# EAGLE design GD32VF103CBT6-Modul (EAGLE 9.6.2)
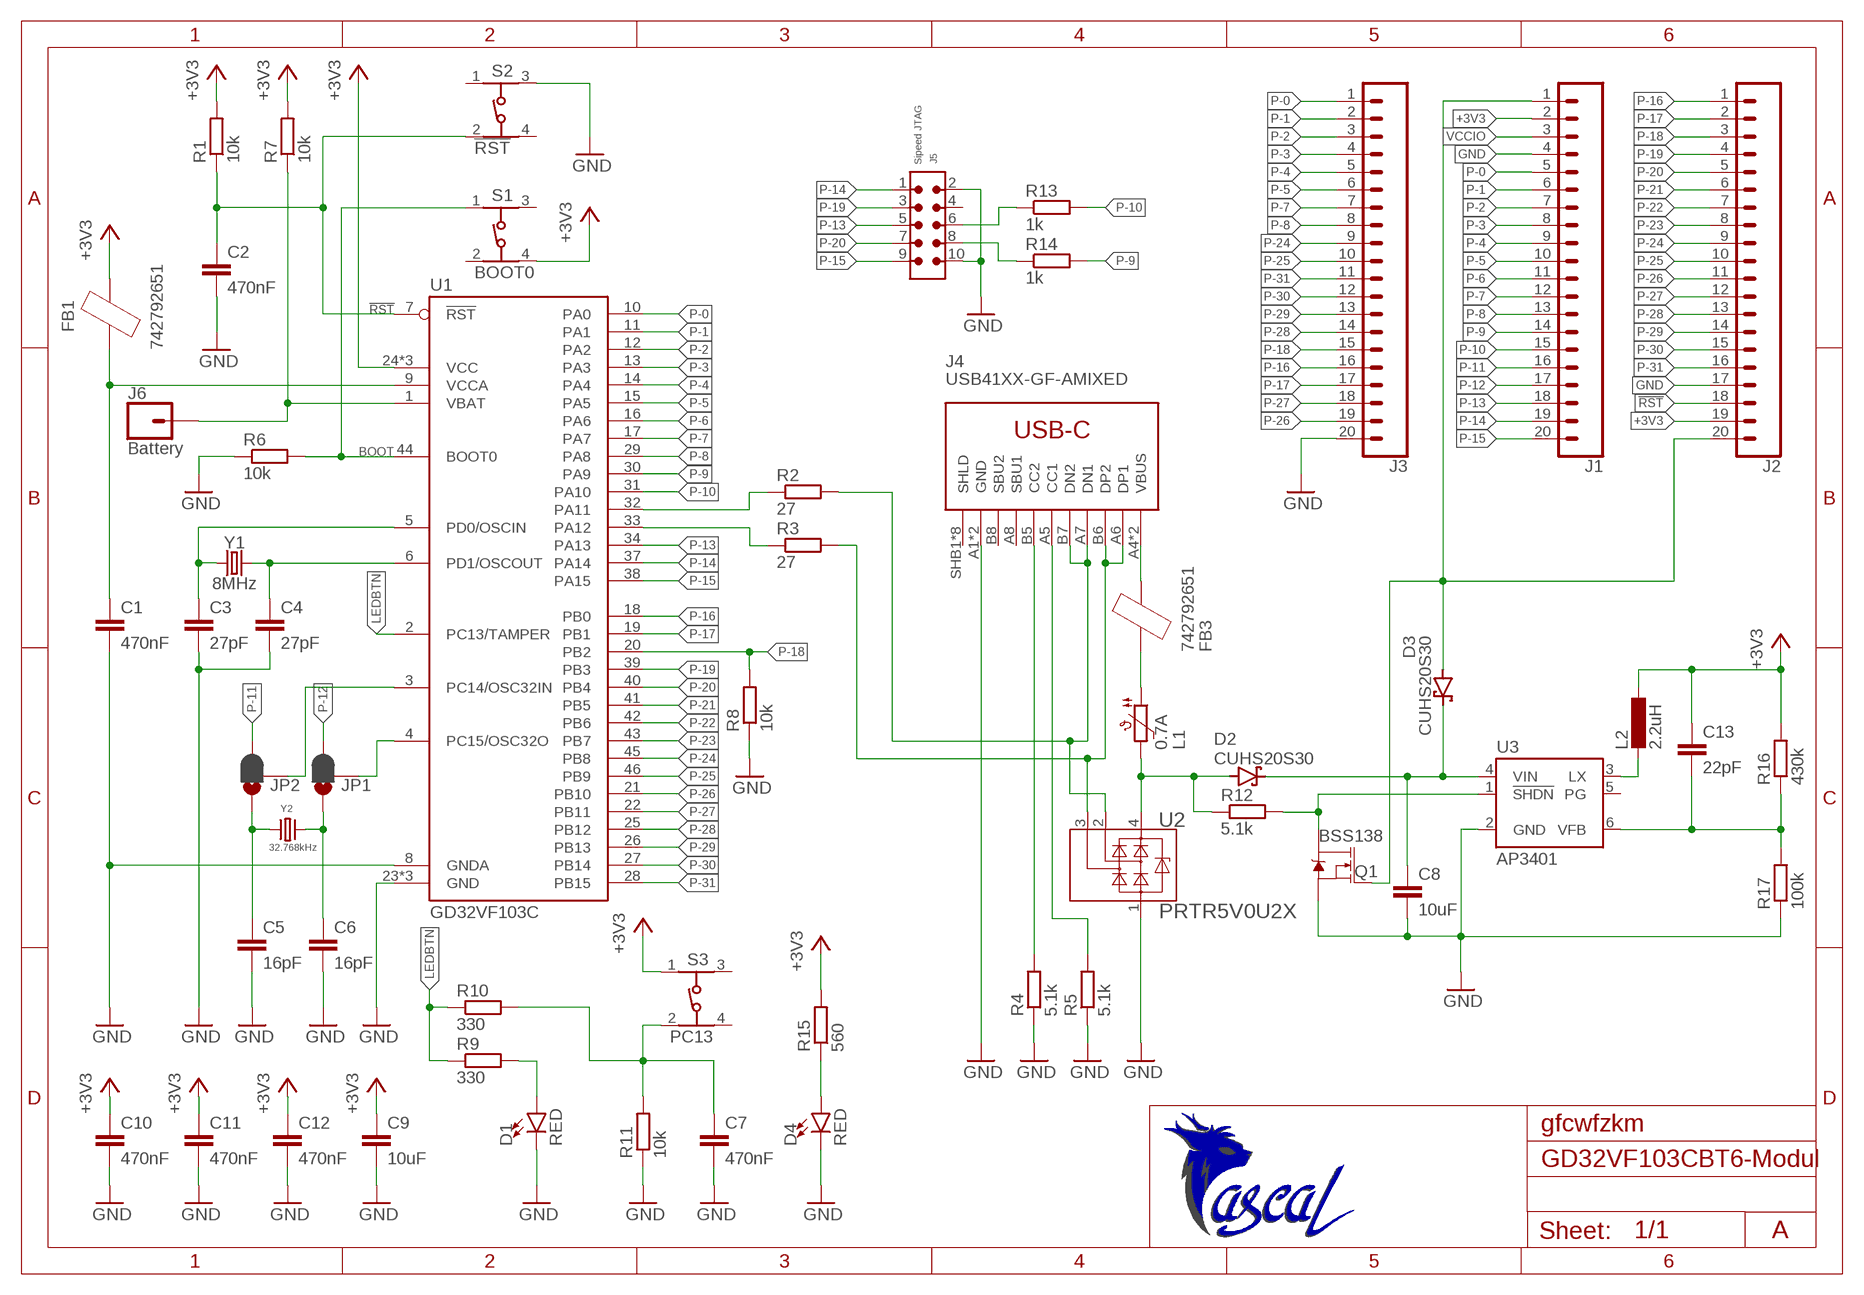
[diagram p0: schematic, sheet 1]

## Parts
C1  470nF  C-EUC0603  [C0603]
C2  470nF  C-EUC0603  [C0603]
C3  27pF  C-EUC0603  [C0603]
C4  27pF  C-EUC0603  [C0603]
C5  16pF  C-EUC0603  [C0603]
C6  16pF  C-EUC0603  [C0603]
C7  470nF  C-EUC0603  [C0603]
C8  10uF  C-EUC0603  [C0603]
C9  10uF  C-EUC0603  [C0603]
C10  470nF  C-EUC0603  [C0603]
C11  470nF  C-EUC0603  [C0603]
C12  470nF  C-EUC0603  [C0603]
C13  22pF  C-EUC0603  [C0603]
D1  RED  LED-RED0603  [LED-0603]
D2  CUHS20S30  [US2H]
D3  CUHS20S30  [US2H]
D4  RED  LED-RED0603  [LED-0603]
FB1  742792651  FERRITE_BEAD  [R0603]
FB3  742792651  FERRITE_BEAD  [R0603]
J1  CONN_20  [1X20]
J2  CONN_20  [1X20]
J3  CONN_20  [1X20]
J4  USB41XX-GF-AMIXED  [USB4105-GF-A]
J5  Sipeed JTAG  6120XX21621_61201021621  [61201021621]
J6  Battery  CONN_01  [1X01]
JP1  JUMPER-SMT_3_1-NC_PASTE_SILK  [SMT-JUMPER_3_1-NC_PASTE_SILK]
JP2  JUMPER-SMT_3_1-NC_PASTE_SILK  [SMT-JUMPER_3_1-NC_PASTE_SILK]
L1  0.7A  PTC_FUSE0805  [R0805]
L2  2.2uH  L1210  [R1210]
Q1  BSS138  MOSFET-NCH-BSS138  [SOT23-3]
R1  10k  R-EU_R0603  [R0603]
R2  27  R-EU_R0603  [R0603]
R3  27  R-EU_R0603  [R0603]
R4  5.1k  R-EU_R0603  [R0603]
R5  5.1k  R-EU_R0603  [R0603]
R6  10k  R-EU_R0603  [R0603]
R7  10k  R-EU_R0603  [R0603]
R8  10k  R-EU_R0603  [R0603]
R9  330  R-EU_R0603  [R0603]
R10  330  R-EU_R0603  [R0603]
R11  10k  R-EU_R0603  [R0603]
R12  5.1k  R-EU_R0603  [R0603]
R13  1k  R-EU_R0603  [R0603]
R14  1k  R-EU_R0603  [R0603]
R15  560  R-EU_R0603  [R0603]
R16  430k  R-EU_R0603  [R0603]
R17  100k  R-EU_R0603  [R0603]
S1  BOOT0  434153017835  [434153017835]
S2  !RST  434153017835  [434153017835]
S3  PC13  434153017835  [434153017835]
U1  GD32VF103C  [LQFP48]
U2  PRTR5V0U2X  [SOT143B]
U3  AP3401  [TSOT23-6]
U$1  LOGO_PASCAL_GESELL10MM  [LOGO_10MM]
Y1  8MHz  CRYSTAL-8MHZSMD-5X3.2  [CRYSTAL-SMD-5X3.2-4PAD]
Y2  32.768kHz  WE-XTAL_CFPX-56_830025159  [WE-XTAL_CFPX-56]

## Nets
!RST: C2.1 J2.18 R1.1 S2.2 U1.7(!RST)
!SHDN: Q1.3(D) R12.2 U3.1(!SHDN)
+3V3: C9.1 C10.1 C11.1 C12.1 C13.1 FB1.2 J1.2 J2.19 L2.1 R1.2 R7.2 R15.2 R16.2 S1.4 S3.1 U1.24(VCC) U1.36(VCC) U1.48(VCC)
BOOT: R6.2 S1.1 U1.44(BOOT0)
D+: J4.A6(DP1) J4.B6(DP2) R3.2 U2.3
D-: J4.A7(DN1) J4.B7(DN2) R2.2 U2.2
GND: C1.2 C2.2 C3.2 C4.2 C5.2 C6.2 C7.2 C8.2 C9.2 C10.2 C11.2 C12.2 D1.C D4.C J1.4 J2.17 J3.20 J4.A1(GND) J4.B1(GND) J5.2 J5.10 Q1.2(S) R4.1 R5.1 R6.1 R8.1 R11.1 R17.1 S2.3 U1.8(GNDA) U1.23(GND) U1.35(GND) U1.47(GND) U2.1 U3.2(GND)
LEDBTN: R9.1 R10.1 U1.2(PC13/TAMPER)
LX: L2.2 U3.3(LX)
N$1: C3.1 U1.5(PD0/OSCIN) Y1.1
N$2: C4.1 U1.6(PD1/OSCOUT) Y1.3
N$3: JP2.2 U1.3(PC14/OSC32IN)
N$4: JP1.2 U1.4(PC15/OSC32O)
N$5: R2.1 U1.32(PA11)
N$6: R3.1 U1.33(PA12)
N$7: J4.B5(CC2) R4.2
N$8: J4.A5(CC1) R5.2
N$9: FB3.1 L1.1
N$11: D2.A L1.2 R12.1 U2.4
N$12: C6.1 JP1.1 Y2.2
N$13: C5.1 JP2.1 Y2.1
N$14: C1.1 FB1.1 U1.9(VCCA)
N$16: C7.1 R10.2 R11.2 S3.2
N$17: D1.A R9.2
N$18: J6.1 R7.1 U1.1(VBAT)
N$19: D3.A J1.1 J2.20 Q1.1(G)
N$25: J5.6 R13.1
N$26: J5.8 R14.1
N$39: D4.A R15.1
P-0: J1.5 J3.1 U1.10(PA0)
P-1: J1.6 J3.2 U1.11(PA1)
P-2: J1.7 J3.3 U1.12(PA2)
P-3: J1.8 J3.4 U1.13(PA3)
P-4: J1.9 J3.5 U1.14(PA4)
P-5: J1.10 J3.6 U1.15(PA5)
P-6: J1.11 U1.16(PA6)
P-7: J1.12 J3.7 U1.17(PA7)
P-8: J1.13 J3.8 U1.29(PA8)
P-9: J1.14 R14.2 U1.30(PA9)
P-10: J1.15 R13.2 U1.31(PA10)
P-11: J1.16 JP2.3
P-12: J1.17 JP1.3
P-13: J1.18 J5.5 U1.34(PA13)
P-14: J1.19 J5.1 U1.37(PA14)
P-15: J1.20 J5.9 U1.38(PA15)
P-16: J2.1 J3.16 U1.18(PB0)
P-17: J2.2 J3.17 U1.19(PB1)
P-18: J2.3 J3.15 R8.2 U1.20(PB2)
P-19: J2.4 J5.3 U1.39(PB3)
P-20: J2.5 J5.7 U1.40(PB4)
P-21: J2.6 U1.41(PB5)
P-22: J2.7 U1.42(PB6)
P-23: J2.8 U1.43(PB7)
P-24: J2.9 J3.9 U1.45(PB8)
P-25: J2.10 J3.10 U1.46(PB9)
P-26: J2.11 J3.19 U1.21(PB10)
P-27: J2.12 J3.18 U1.22(PB11)
P-28: J2.13 J3.14 U1.25(PB12)
P-29: J2.14 J3.13 U1.26(PB13)
P-30: J2.15 J3.12 U1.27(PB14)
P-31: J2.16 J3.11 U1.28(PB15)
VBUS: FB3.2 J4.A4(VBUS) J4.B4(VBUS)
VCCIO: J1.3
VFB: C13.2 R16.1 R17.2 U3.6(VFB)
VIN: C8.1 D2.C D3.C U3.4(VIN)
Unconnected: J4.A8(SBU1) J4.B8(SBU2) J4.SHB1(SHLD) J4.SHB2(SHLD) J4.SHB3(SHLD) J4.SHB4(SHLD) J4.SHT1(SHLD) J4.SHT2(SHLD) J4.SHT3(SHLD) J4.SHT4(SHLD) J5.4 S1.2 S1.3 S2.1 S2.4 S3.3 S3.4 U3.5(PG)

## Notes on the sheet
- gfcwfzkm
- A

## Library data of the parts
C1-C13 = rcl:C-EU: CAPACITOR, European symbol; SPICEPREFIX: C
D1 D4 = SparkFun-LED:LED-RED: Red SMD LED Used in manufacturing of most products at SparkFun Packages: 0603 - SMD 0603 package [Product Link] <http://docs.avagotech.com/docs/AV02-0551EN> 0603 SMART - SMD 0603 SMART package ( more efficient and expensive)[Product Link] <http://www.osram-os.com/Graphics/XPic2/00077099_0.pdf> 1206 - SMD1206 package [Product Link] <https://www.sparkfun.com/datasheets/DevTools/LilyPad/Q150OVS4.pdff> SparkFun Products: Pro Mini 328 -5V <https://www.sparkfun.com/products/821> RedBoard <https://www.sparkfun.com/products/12757> IOIO-OTG <https://www.sparkfun.com/products/13613>; PROD_ID: DIO-00819
D2 D3 = Elektroniker MGB:CUHS: CUHSxx High Speed Schottky Barrier Diode Series With a Very Low Vf Voltage CUHS15F40 <https://toshiba.semicon-storage.com/info/docget.jsp?did=63603&prodName=CUHS15F40>, CUHS20S30 <https://toshiba.semicon-storage.com/info/docget.jsp?did=63606&prodName=CUHS20S30>, CUHS20S40 <https://toshiba.semicon-storage.com/info/docget.jsp?did=63610&prodName=CUHS20S40>, CUHS20F30 <https://toshiba.semicon-storage.com/info/docget.jsp?did=63604&prodName=CUHS20F30>, CUHS20F40 <https://toshiba.semicon-storage.com/info/docget.jsp?did=63600&prodName=CUHS20F40>
FB1 FB3 = Elektroniker MGB:FERRITE_BEAD
J1-J3 = SparkFun-Connectors:CONN_20: Multi connection point. Often used as Generic Header-pin footprint for 0.1 inch spaced/style header connections On any of the 0.1 inch spaced packages, you can populate with these: Break Away Headers - Straight <https://www.sparkfun.com/products/116> (PRT-00116) Break Away Male Headers - Right Angle <https://www.sparkfun.com/products/553> (PRT-00553) Female Headers <https://www.sparkfun.com/products/115> (PRT-00115) Break Away Headers - Machine Pin <https://www.sparkfun.com/products/117> (PRT-00117) Break Away Female Headers - Swiss Machine Pin <https://www.sparkfun.com/products/743> (PRT-00743) For SCREWTERMINALS and SPRING TERMINALS visit here: Screw Terimnals on SparkFun.com <https://www.sparkfun.com/search/results?term=Screw+Terminals> (5mm/3.5mm/2.54mm spacing) This device is also useful as a general connection point to wire up your design to another part of your project. Our various solder wires solder well into these plated through hole pads. Hook-Up Wire - Assortment (Stranded, 22 AWG) <https://www.sparkfun.com/products/11375> (PRT-11375) Hook-Up Wire - Assortment (Solid Core, 22 AWG) <https://www.sparkfun.com/products/11367> (PRT-11367) View the entire wire category on our website here <https://www.sparkfun.com/categories/141> Special notes: Molex polarized connector foot print use with SKU : PRT-08231 with associated crimp pins and housings. 1MM SMD Version SKU: PRT-10208 NOTES ON THE VARIANTS LOCK and LOCK_LONGPADS... This footprint was designed to help hold the alignment of a through-hole component (i.e. 6-pin header) while soldering it into place. You may notice that each hole has been shifted either up or down by 0.005 of an inch from it's more standard position (which is a perfectly straight line). This slight alteration caused the pins (the squares in the middle) to touch the edges of the holes. Because they are alternating, it causes a "brace" to hold the component in place. 0.005 has proven to be the perfect amount of "off-center" position when using our standard breakaway headers. Although looks a little odd when you look at the bare footprint, once you have a header in there, the alteration is very hard to notice. Also,if you push a header all the way into place, it is covered up entirely on the bottom side. Note about LOCK SPECIAL package: This is just like the LOCK variant in that the holes are staggared by 5 mil, but except for the last two holes. They are not altered from the "standard" footprint layout. This is used for a special purpose on the layout of our Graphic LCD Backpack. Make sure you want to use this device before selecting it for you project!
J4 = Pascal_Library:USB41XX-GF-A
J5 = Wurth_Connectors_WR-BHD:6120XX21621_61201021621: WR-BHD 2.54 mm Male Box Header KIND PROPERTIES: Pitch 2.54 mm Gender:Male MATERIAL PROPERTIES: Insulator Material:PBT Insulator Flammability Rating UL94 V-0 Insulator Color:Black Contact Material :Copper Alloy Contact Plating :Gold Contact Type: Stamped GENERAL INFORMATION: Operating Temperature:-40 °C up to +125 °C Compliance:RoHS Working Voltage: 250 V (AC) Withstanding Voltage:500 V (AC) Contact Resistance: 20 mΩ Insulation Resistance:1000 MΩ CERTIFICATION: UL Approval:E323964 PACKAGING PROPERTIES Packaging :Tray <https://www.we-online.com/catalog/media/o32884v209%20Family_WR-BHD_6120xx21621.jpg> Details see: https://www.we-online.com/catalog/en/BHD_2_54_MALE_BOX_HEADER_6120XX21621 Updated by Ella Wu 2021-3-12 2021 (C) Würth Elektronik; CONTACT-RESISTANCE: 20mOhm; DATASHEET-URL: https://www.we-online.com/catalog/datasheet/61201021621.pdf; GENDER: Male; IR: 3A; L: 20.36mm; MOUNT: THT; PACKAGING: Tray; PART-NUMBER: 61201021621; PINS: 10; PITCH: 2.54mm; TYPE: Straight; VALUE: 61201021621; WORKING-VOLTAGE: 250V(AC)
J6 = SparkFun-Connectors:CONN_01: Single connection point. Often used as Generic Header-pin footprint for 0.1 inch spaced/style header connections On any of the 0.1 inch spaced packages, you can populate with these: Break Away Headers - Straight <https://www.sparkfun.com/products/116> (PRT-00116) Break Away Male Headers - Right Angle <https://www.sparkfun.com/products/553> (PRT-00553) Female Headers <https://www.sparkfun.com/products/115> (PRT-00115) Break Away Headers - Machine Pin <https://www.sparkfun.com/products/117> (PRT-00117) Break Away Female Headers - Swiss Machine Pin <https://www.sparkfun.com/products/743> (PRT-00743) This device is also useful as a general connection point to wire up your design to another part of your project. Our various solder wires solder well into these plated through hole pads. Hook-Up Wire - Assortment (Stranded, 22 AWG) <https://www.sparkfun.com/products/11375> (PRT-11375) Hook-Up Wire - Assortment (Solid Core, 22 AWG) <https://www.sparkfun.com/products/11367> (PRT-11367) View the entire wire category on our website here <https://www.sparkfun.com/categories/141> Special notes: SMTSO-256-ET is a "flush mount" nut for a 4-40 screw. We mostly use this on specialty testbeds; it is a nice way to connect hardware to your PCB at an adjustable hieght. Also note, the SNAP packages are for using a snappable style connector. We sell a baggie of snaps and they are also used on two LilyPad designs: Snap Assortment - 30 pack (male and female) <https://www.sparkfun.com/products/11347> (DEV-11347) LilyPad Arduino SimpleSnap <https://www.sparkfun.com/products/10941> (DEV-10941) LilyPad SimpleSnap Protoboard <https://www.sparkfun.com/products/10940> (DEV-10940)
JP1 JP2 = SparkFun-Jumpers:JUMPER-SMT_3_1-NC_PASTE: Normally closed solder jumper (1 of 2 connections) This jumper has an aperture in the stencil to allow solder paste to bridge one of the two connections. One connection is normally closed (NC), while the other is normally open (NO). Wick off the solder to open the connection. Reapply solder to reclose the connection. Apply solder to the other side instead to change the current path.
L1 = Elektroniker MGB:PTC_FUSE
L2 = Pascal_Library:L
Q1 = SparkFun-DiscreteSemi:MOSFET-NCH: N-channel MOSFETs Voltage controlled devices that allow control of high current outputs. SparkFun Products: SparkFun OpenScale <https://www.sparkfun.com/products/13261> SparkFun Digital Sandbox <https://www.sparkfun.com/products/12651> SparkFun Monster Moto Shield <https://www.sparkfun.com/products/10182> SparkFun MOSFET Power Controller <https://www.sparkfun.com/products/11214>; PROD_ID: TRANS-00830; VALUE: 220mA/50V/3.5Ω
R1-R17 = rcl:R-EU_: RESISTOR, European symbol; SPICEPREFIX: R
S1-S3 = Wurth_Switch_WS-TASV:434153017835: WS-TASV J-Bend SMT Tact Switch 3.5x2.9 mm Material Properties Cover Material : Stainless Steel Properties Actuator Material:LCP Actuator Flammability Rating:UL94 V-0 Actuator Color:Blue Frame Material:PA46 Frame Flammability Rating:UL94 HB Frame Color:Black Contact Material:Stainless Steel Contact Plating:Silver Terminal Material:Copper Alloy Terminal Plating:Silver VR:12 V (DC) Contact Resistance Initial:100 mΩ Contact Resistance After Life Test:1 Ω RISO:100 MΩ Withstanding Voltage:250 V (AC) Washable:No Qty.:4000 Mechanical Properties Stroke :0.15 mm General Information Operating Temperature:-40 up to +85 °C Washable:No Packaging Properties Packaging:Tape and Reel <https://www.we-online.com/catalog/media/o72753v209%20WS-TASU_434331013822_a_4C.jpg> Details see: https://www.we-online.com/catalog/en/TASV_3_5X2_9_SMD_J-BEND/ Updated by yingchun,Shan;2020-02-18 2020(C) Würth Elektronik; DATASHEET-URL: https://www.we-online.com/catalog/datasheet/434153017835.pdf; H: 1.7mm; OPERATION-FORCE: 350g; PART-NUMBER: 434153017835; QTY: 4000
U1 = Pascal_Library:GD32VF103C
U2 = Elektroniker MGB:PRTR5V0U2X: PRTR5V0U2X - Ultra low capacitance double rail-to-rail ESD protection diode Ultra low capacitance rail-to-rail ElectroStatic Discharge (ESD) protection diode in a small SOT143B Surface-Mounted Device (SMD) plastic package designed to protect two Hi-Speed data lines or high-frequency signal lines from the damage caused by ESD and other transients. PRTR5V0U2X incorporates two pairs of ultra low capacitance rail-to-rail diodes as well as an additional ESD protection diode to ensure signal line protection even if no supply voltage is available.
U3 = Pascal_Library:AP3401
U$1 = Pascal_Library:LOGO_PASCAL_GESELL: Mein Logo halt
Y1 = SparkFun-Clocks:CRYSTAL-8MHZ: 8MHz Crystal Datasheet Example <http://www.futureelectronics.com/en/technologies/electromechanical/timing-devices/crystals/Pages/6008189-ABM3B-8.000MHZ-B2-T.aspx?IM=0> Frequency: 8MHz Frequency Tolerance: ±20ppm Load Capacitance: 18pF SparkFun Products: Pro Micro -3.3V/8MHz <https://www.sparkfun.com/products/12587> WAV Trigger <https://www.sparkfun.com/products/13660>; PROD_ID: XTAL-09431
Y2 = Wurth_Quartz Crystals & Oscillators_WE-XTAL:WE-XTAL_CFPX-56: WE-XTAL Watch Crystals Characteristics SMT and THT models Hermetically sealed Frequency: 32.768 kHz Tolerances down to ±10 ppm available Characteristics Microprocessor Real Time Clocks Test and Measurement Equipment Battery powered Applications <https://www.we-online.com/catalog/media/o162740v209%20Family_WE-XTAL_WatchCrystal.jpg> Details see: https://www.we-online.com/catalog/en/WE-XTAL_WATCHCRYSTAL Updated by Ella Wu, 2020-10-30 2020 (C) Wurth Elektronik; C-LOAD: 12.5pF; DATASHEET-URL: https://www.we-online.com/catalog/datasheet/830025159.pdf; MOUNT: SMT; PART-NUMBER: 830025159; TOLERANCE: ±20ppm

## Board
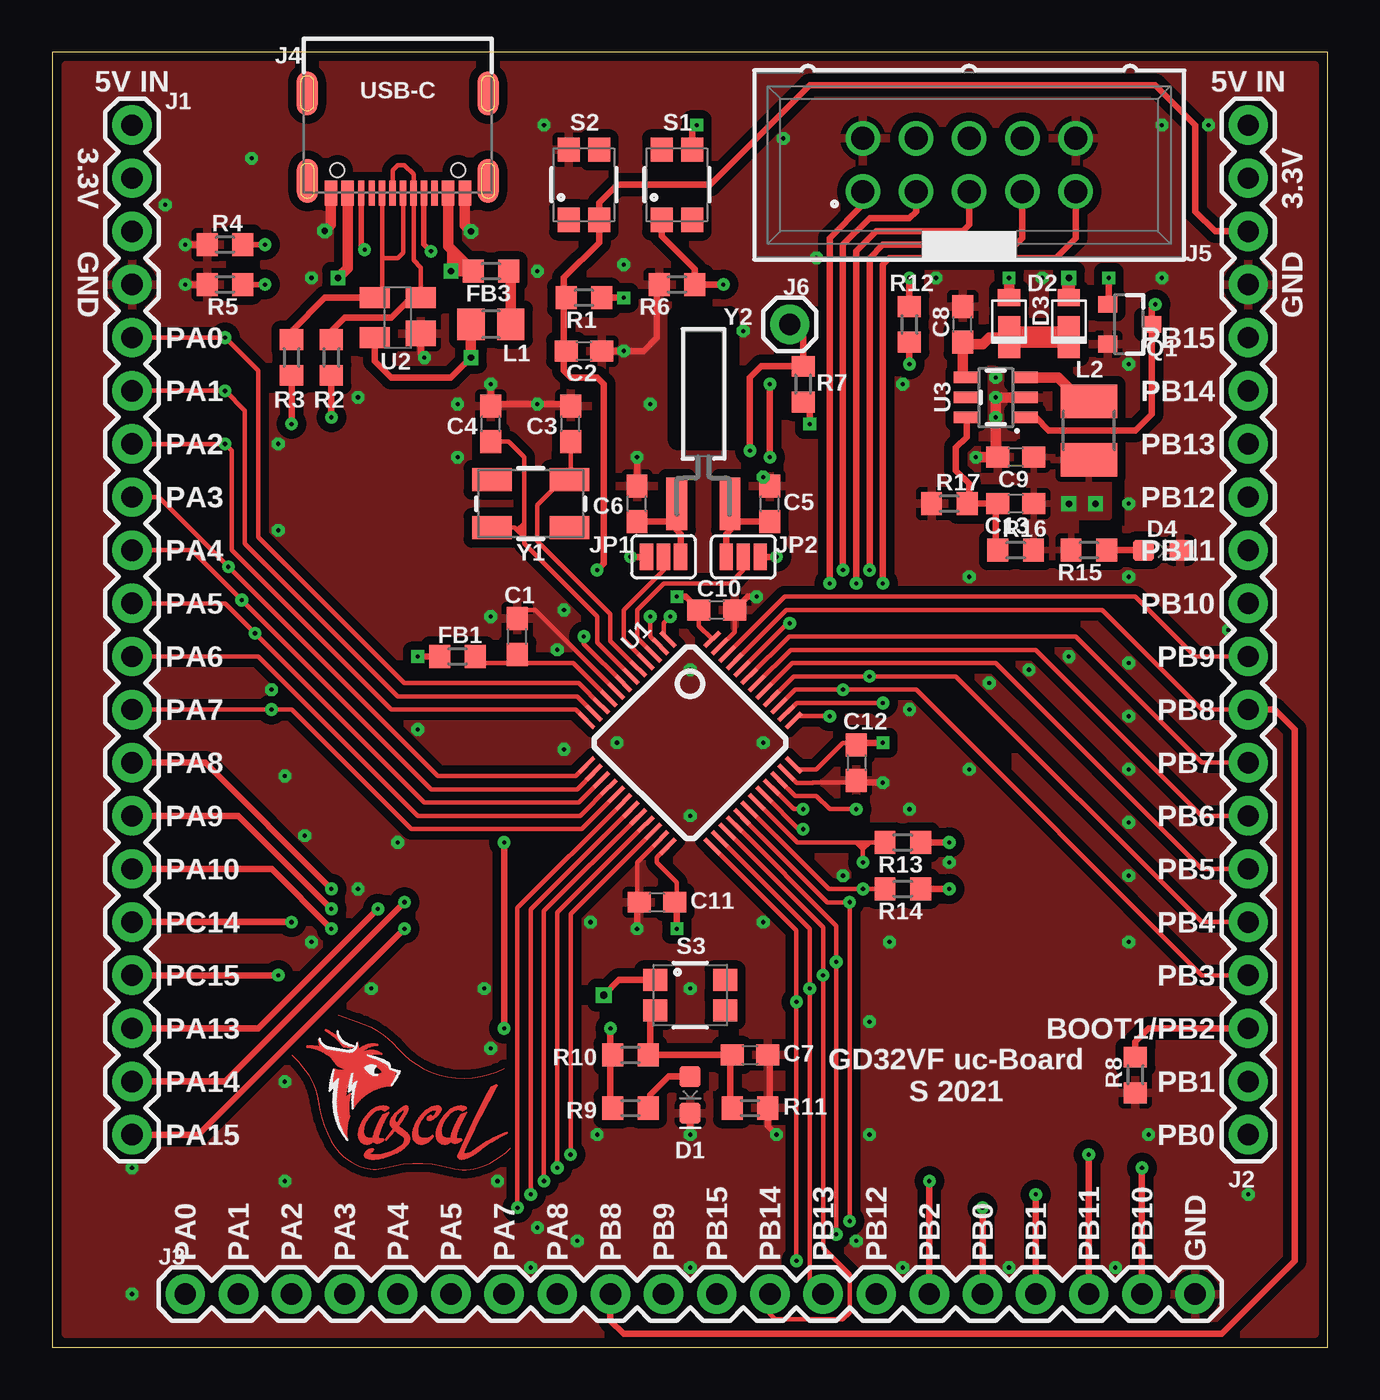
[diagram p1: board, top side]
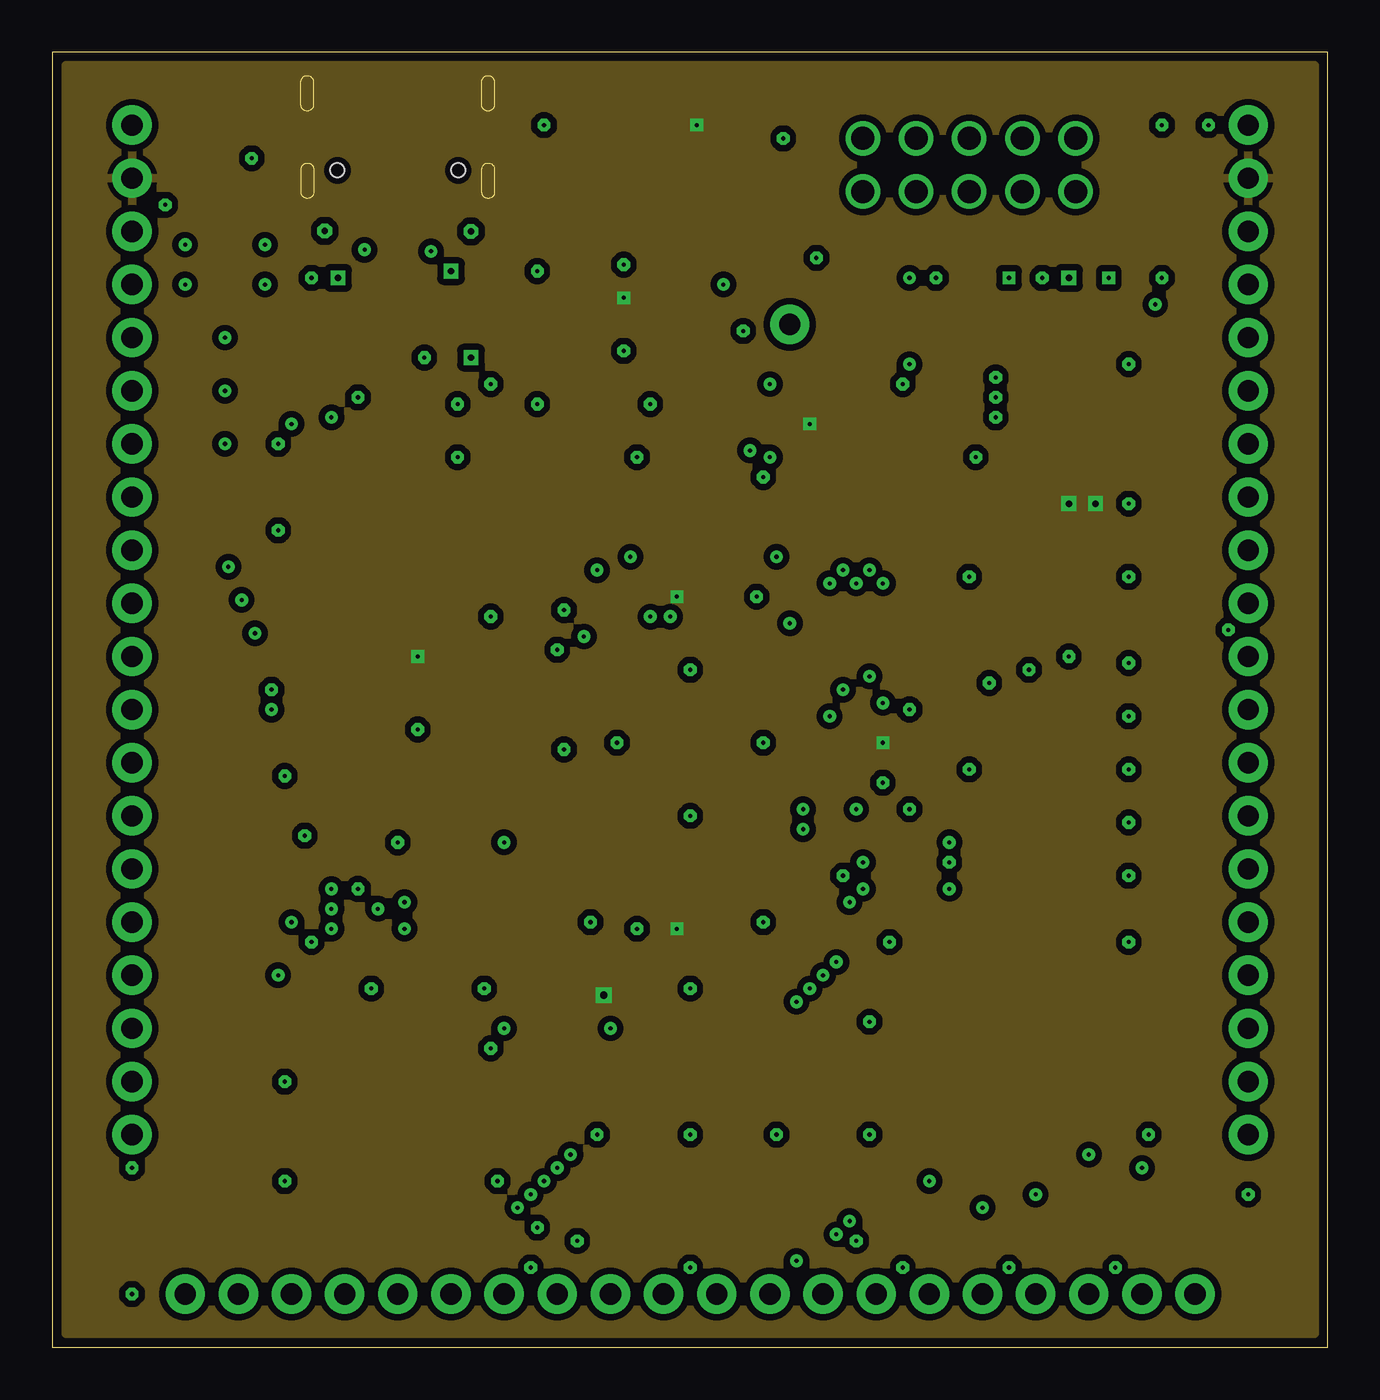
[diagram p2: board, inner layer Route2]
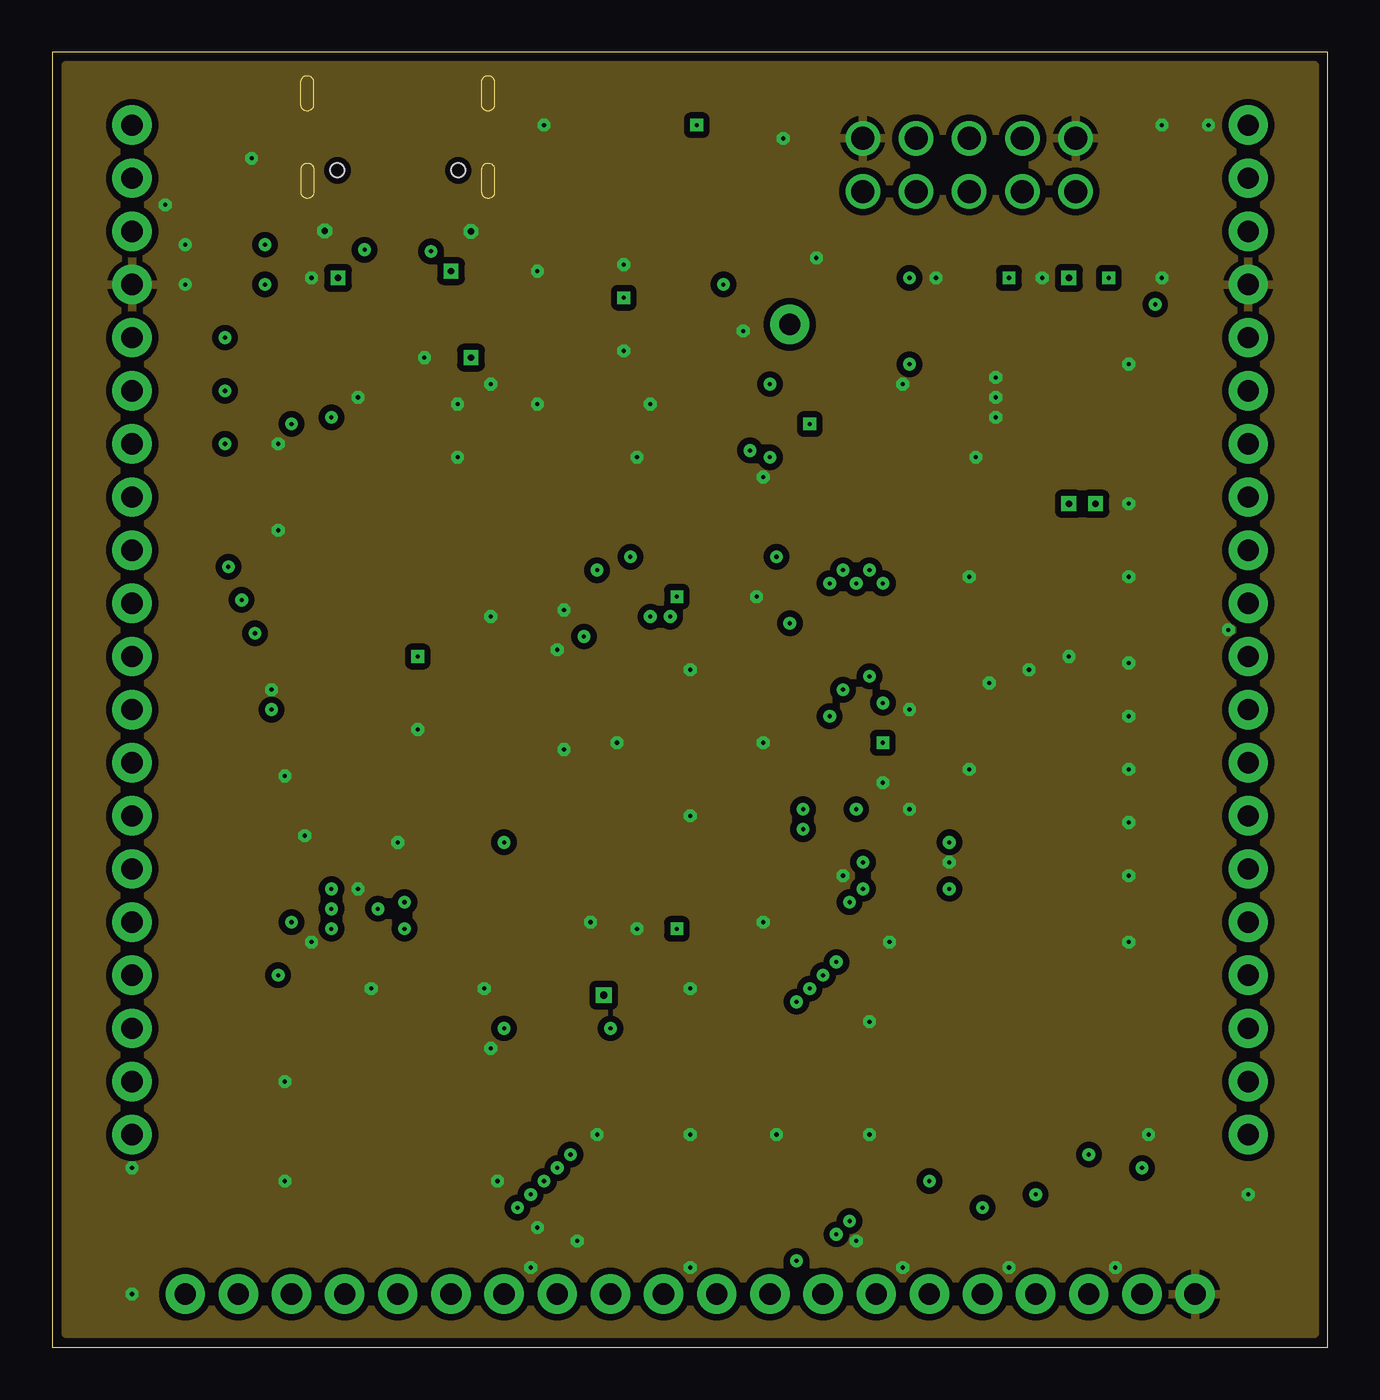
[diagram p3: board, inner layer Route15]
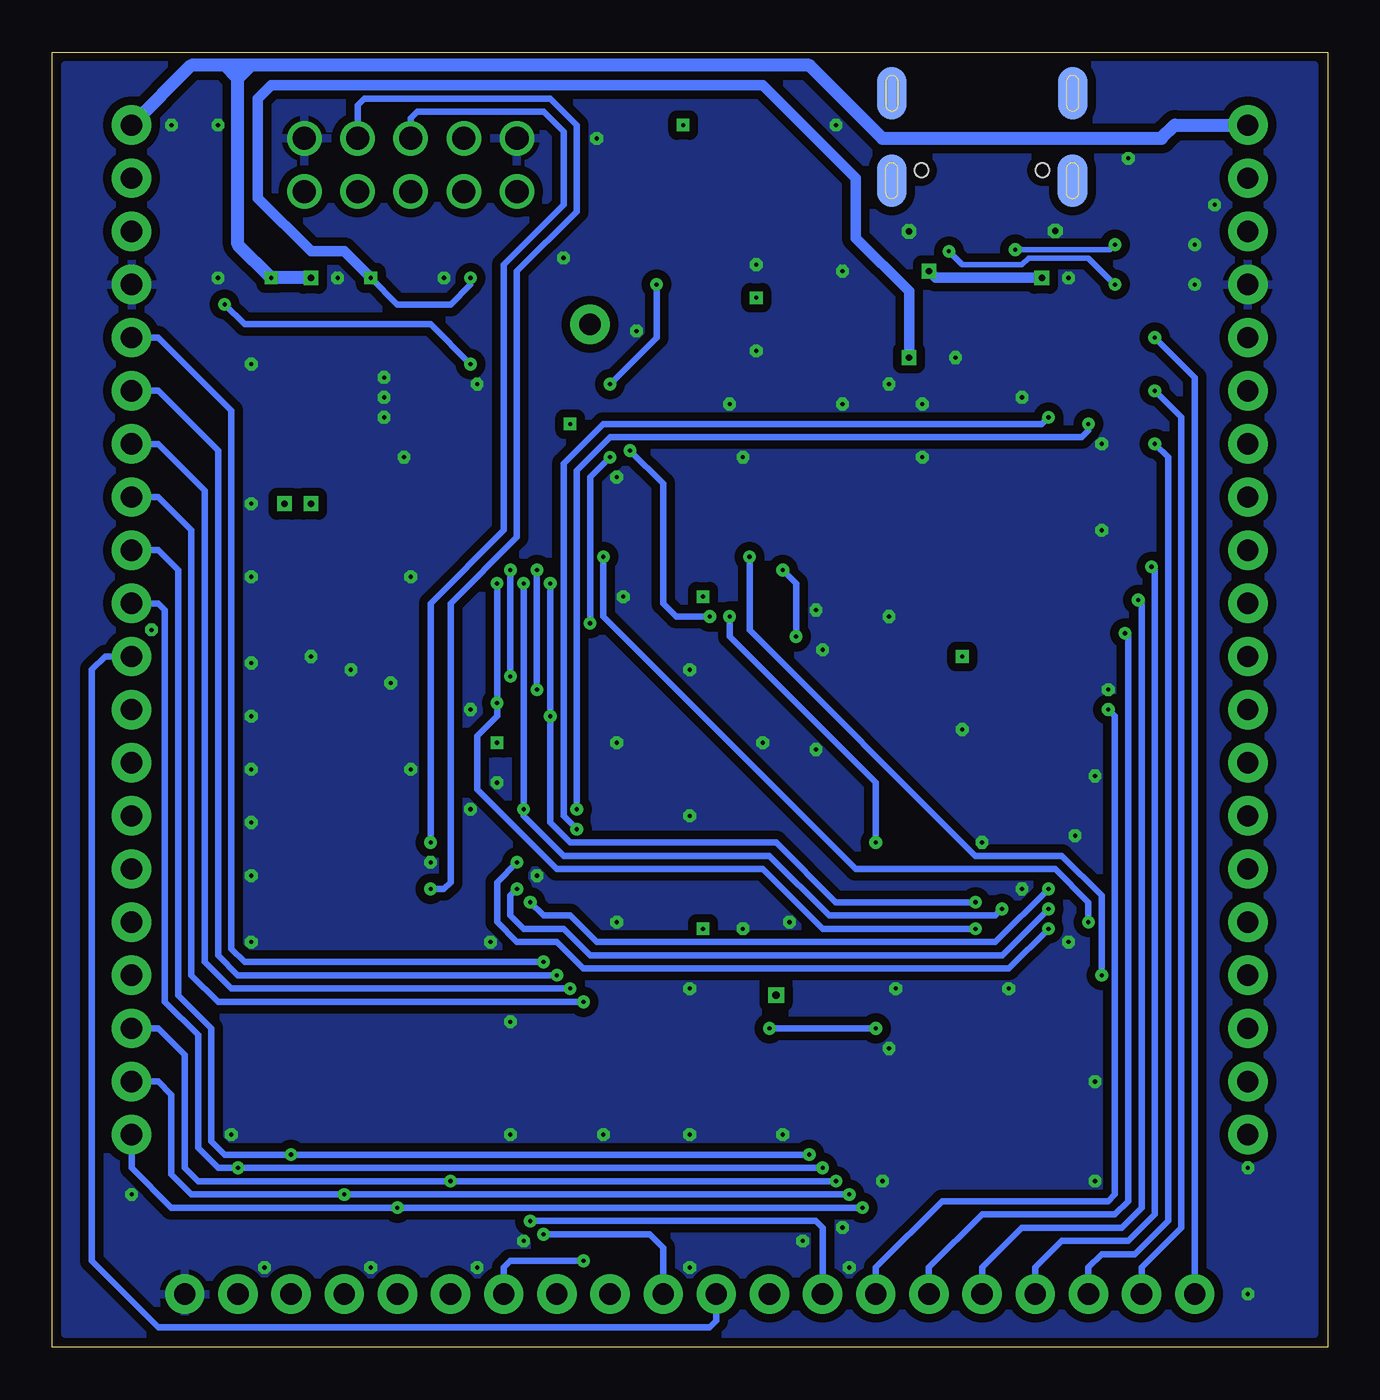
[diagram p4: board, bottom side, seen from below]

Size 60.94 x 61.9 mm. Coordinates in mm from the lower left corner, seen from the top.
Outline: 0,0 60.94,0 60.94,61.9 0,61.9 0,0
Copper layers (1+2*15+16): Top 0.035mm / dielectric 0.2mm / Route2 0.035mm / dielectric 1mm / Route15 0.035mm / dielectric 0.2mm / Bottom 0.035mm
Design rules "jlcpcb_4_layers": minimum track width 5mil, minimum drill 0.2mm, track to track 5mil, track to pad 6mil, pad to pad 6mil, via to via 6mil, smd to smd 6mil, copper to edge 0mil, drill to drill 6mil, minimum pad ring 10mil, minimum via ring 8mil, stop-mask expansion 4mil, vias tented up to drill 0mil, thermal gap 10mil

### Footprints (pad centres in the part's own frame; a part is rotated, then mirrored left to right if it is on the bottom)
C0603 = smd 1.1 x 1: 1 -0.85,0; 2 0.85,0
LED-0603 = smd 1 x 1: A -0.877,0; C 0.877,0
US2H = smd 0.8 x 1.1: A 0.65,0 | smd 2 x 1.1: C -1.25,0
R0603 = smd 1 x 1.1: 1 -0.85,0; 2 0.85,0
1X20 = drill 1.016 pad 1.88: 1 0,0; 2 2.54,0; 3 5.08,0; 4 7.62,0; 5 10.16,0; 6 12.7,0; 7 15.24,0; 8 17.78,0; 9 20.32,0; 10 22.86,0; 11 25.4,0; 12 27.94,0; 13 30.48,0; 14 33.02,0; 15 35.56,0; 16 38.1,0; 17 40.64,0; 18 43.18,0; 19 45.72,0; 20 48.26,0
USB4105-GF-A = smd 0.6 x 1.2: A1 -3.2,4.53; A4 -2.4,4.53; B1 3.2,4.53; B4 2.4,4.53 | smd 0.3 x 1.2: A5 -1.25,4.53; A6 -0.25,4.53; A7 0.25,4.53; A8 1.25,4.53; B5 1.75,4.53; B6 0.75,4.53; B7 -0.75,4.53; B8 -1.75,4.53 | smd 1.4 x 2.5 bottom: SHB1 -4.32,3.93; SHB2 -4.31,-0.25; SHB3 4.32,3.93; SHB4 4.33,-0.25 | smd 1 x 2.1: SHT1 -4.32,3.93; SHT2 -4.31,-0.25; SHT3 4.32,3.93; SHT4 4.33,-0.25 | hole 0.65: -2.89,3.43; 2.89,3.43
61201021621 = drill 1.1: 1 -5.08,-1.27; 2 -5.08,1.27; 3 -2.54,-1.27; 4 -2.54,1.27; 5 0,-1.27; 6 0,1.27; 7 2.54,-1.27; 8 2.54,1.27; 9 5.08,-1.27; 10 5.08,1.27
1X01 = drill 1.016 pad 1.88: 1 0,0
SMT-JUMPER_3_1-NC_PASTE_SILK = smd 0.635 x 1.27: 1 -0.813,0; 2 0,0; 3 0.813,0
R0805 = smd 1.3 x 1.5: 1 -0.95,0; 2 0.95,0
R1210 = smd 1.6 x 2.7: 1 -1.4,0; 2 1.4,0
SOT23-3 = smd 0.8 x 0.9: 1 -0.95,-1; 2 0.95,-1; 3 0,1.1
434153017835 = smd 1.15 x 1.05: 1 -1.675,0.725; 2 -1.675,-0.725; 3 1.675,0.725; 4 1.675,-0.725
LQFP48 = smd 0.2 x 1: 1 -2.75,-4.25; 2 -2.25,-4.25; 3 -1.75,-4.25; 4 -1.25,-4.25; 5 -0.75,-4.25; 6 -0.25,-4.25; 7 0.25,-4.25; 8 0.75,-4.25; 9 1.25,-4.25; 10 1.75,-4.25; 11 2.25,-4.25; 12 2.75,-4.25; 25 2.75,4.25; 26 2.25,4.25; 27 1.75,4.25; 28 1.25,4.25; 29 0.75,4.25; 30 0.25,4.25; 31 -0.25,4.25; 32 -0.75,4.25; 33 -1.25,4.25; 34 -1.75,4.25; 35 -2.25,4.25; 36 -2.75,4.25 | smd 1 x 0.2: 13 4.25,-2.75; 14 4.25,-2.25; 15 4.25,-1.75; 16 4.25,-1.25; 17 4.25,-0.75; 18 4.25,-0.25; 19 4.25,0.25; 20 4.25,0.75; 21 4.25,1.25; 22 4.25,1.75; 23 4.25,2.25; 24 4.25,2.75; 37 -4.25,2.75; 38 -4.25,2.25; 39 -4.25,1.75; 40 -4.25,1.25; 41 -4.25,0.75; 42 -4.25,0.25; 43 -4.25,-0.25; 44 -4.25,-0.75; 45 -4.25,-1.25; 46 -4.25,-1.75; 47 -4.25,-2.25; 48 -4.25,-2.75
SOT143B = smd 1.2 x 1.44: 1 -0.75,-1.1 | smd 1 x 1.44: 2 0.95,-1.1; 3 0.95,1.1; 4 -0.95,1.1
TSOT23-6 = smd 0.55 x 1.2: 1 -0.95,-1.4; 2 0,-1.4; 3 0.95,-1.4; 4 0.95,1.4; 5 0,1.4; 6 -0.95,1.4
CRYSTAL-SMD-5X3.2-4PAD = smd 1.9 x 1.1: 1 -1.85,-1.15; 2 1.85,-1.15; 3 1.85,1.15; 4 -1.85,1.15
WE-XTAL_CFPX-56 = smd 2.5 x 1: 1 0,1.27; 2 0,-1.27

### Placement (x,y rotation side)
C1  22.23,33.97 90 top
C2  25.4,47.62 0 top
C3  24.77,44.13 90 top
C4  20.95,44.13 90 top
C5  34.29,40.32 90 top
C6  27.94,40.32 90 top
C7  33.34,13.97 0 top
C8  43.5,48.9 90 top
C9  46.04,42.55 180 top
C10  31.75,35.24 0 top
C11  28.89,21.27 180 top
C12  38.42,27.94 270 top
C13  46.04,40.32 180 top
D1  30.48,12.06 270 top
D2  45.72,49.53 90 top
D3  48.58,49.53 90 top
D4  53.02,38.1 0 top
FB1  19.37,33.02 180 top
FB3  20.95,51.44 180 top
J1  3.81,58.42 270 top
J2  57.15,10.16 90 top
J3  6.35,2.54 0 top
J4  16.51,59.69 180 top
J5  43.81,56.52 0 top
J6  35.24,48.9 0 top
JP1  29.21,37.78 180 top
JP2  33.02,37.78 0 top
L1  20.95,48.9 180 top
L2  49.53,43.81 90 top
Q1  51.44,48.9 270 top
R1  25.4,50.16 0 top
R2  13.34,47.31 90 top
R3  11.43,47.31 90 top
R4  8.26,52.7 0 top
R5  8.26,50.8 0 top
R6  29.84,50.8 0 top
R7  35.88,46.04 270 top
R8  51.75,13.02 90 top
R9  27.62,11.43 0 top
R10  27.62,13.97 0 top
R11  33.34,11.43 180 top
R12  40.96,48.9 270 top
R13  40.64,24.13 180 top
R14  40.64,21.91 180 top
R15  49.53,38.1 180 top
R16  46.04,38.1 0 top
R17  42.86,40.32 0 top
S1  29.84,55.56 90 top
S2  25.4,55.56 90 top
S3  30.48,16.83 0 top
U1  30.48,28.89 225 top
U2  16.51,49.21 90 top
U3  45.09,45.4 90 top
U$1  11.43,7.94 0 top
Y1  22.86,40.32 180 top
Y2  31.11,40.32 270 top

### Tracks (layer width: path | path; a pad name or v marks a point on that pad's centre or on a via)
!RST  (via drill 0.2)
  Top 0.203: U1.7 25.4,33.62 v25.4,33.97
  Top 0.305: 24.45,50.06 R1.1 | 24.45,50.06 24.45,51.12 26.12,52.8 S2.2 26.12,54.7 26.99,55.56 31.43,55.56 36.2,60.33 52.7,60.33 54.61,58.42 54.61,54.29 55.56,53.34 J2.18 | 24.45,50.06 24.45,47.73 C2.1 24.45,47.52 24.45,46.67 24.77,46.35 26.04,46.35 26.35,46.04 26.35,37.47 v26.04,37.15
  Bottom 0.305: v26.04,37.15 25.4,36.51 v25.4,33.97
!SHDN  (via drill 0.2)
  Top 0.305: v52.7,49.85 52.53,49.68 Q1.3 52.53,44.6 51.75,43.81 47.62,43.81 46.99,44.45 U3.1 | R12.2 v40.96,46.99
  Bottom 0.305: v52.7,49.85 51.75,48.9 42.86,48.9 v40.96,46.99
+3V3  (via drill 0.2, 0.3, 0.35)
  Top 0.203: U1.48 30.9,34.48 C10.1 | U1.24 28.89,23.42 28.89,23.18 29.84,22.23 29.84,21.38 C11.1 | U1.36 35.64,27.62 36.51,27.62 37.78,28.89 38.31,28.89 C12.1
  Top 0.305: C10.1 30.27,35.88 v29.84,35.88 | FB1.2 v17.46,33.02 | R1.2 v27.3,50.16 | C11.1 29.84,21.17 v29.84,20 | C12.1 38.52,28.89 v39.69,28.89 | R7.2 36.2,44.87 v36.2,44.13 | S3.1 27.08,17.55 v26.35,16.83 | S1.4 30.57,58.19 v30.8,58.42
  other vias: 48.58,40.32 49.85,40.32
  pour Route2 (isolate 0.305): 0.64,61.28 0.64,0.64 60.33,0.64 60.33,61.28
  pour Top: 46.67,38.1 46.67,42.86 50.48,42.86 50.48,39.69 48.9,39.69 48.9,37.78 46.67,37.78
BOOT  (via drill 0.2)
  Top 0.203: U1.44 35.13,34.61 v35.24,34.61
  Top 0.305: v34.29,42.55 v34.29,46.04 | v32.07,50.8 R6.2 30.7,51.54 29.12,53.11 S1.1
  Bottom 0.305: v35.24,34.61 35.24,41.59 v34.29,42.55 | v34.29,46.04 32.07,48.26 v32.07,50.8
D+
  Top 0.203: J4.B6 15.76,52.07 | 15.76,52.07 15.76,50.51 U2.3 | J4.A6 16.76,52.32 16.51,52.07 15.76,52.07
  Top 0.305: R3.2 11.43,48.58 13.02,50.16 U2.3
D-
  Top 0.203: U2.2 17.61,51.6 17.26,51.95 J4.B7 17.26,56.08 16.83,56.52 16.51,56.52 16.26,56.27 J4.A7
  Top 0.305: R2.2 13.34,48.58 13.97,49.21 16.19,49.21 17.14,50.16 U2.2
GND  (via drill 0.2, 0.3)
  Top 0.203: U1.47 32.6,34.19 C10.2 | U1.23 27.94,23.17 27.94,21.38 C11.2 | U1.35 35.58,26.98 36.33,26.98 36.34,26.99 38.31,26.99 C12.2 | U1.8 23.07,35.24 22.23,35.24 C1.2
  Top 0.305: C3.2 24.66,45.09 v23.18,45.09 21.06,45.09 C4.2 v20.95,46.04 | C10.2 33.23,35.88 v33.66,35.88 | C2.2 v27.3,47.62 28.26,47.62 28.89,48.26 28.89,50.7 R6.1 | 30.48,11.11 D1.C v30.48,10.16 | C11.2 27.94,21.17 v27.94,20 | C12.2 38.52,26.99 v39.69,26.99 | R5.1 v6.35,50.8 | R4.1 v6.35,52.7 | C6.2 v27.94,42.55 | C5.2 33.97,41.49 v33.97,41.59 | U2.1 17.61,47.48 v17.78,47.31 | C7.2 34.29,13.87 34.29,11.53 R11.1 34.19,10.58 v34.61,10.16
  Top 0.508: J4.B1 13.31,53.66 v13.02,53.36 | J4.A1 19.71,53.63 v20,53.34 | U3.2 v45.09,45.4 45.09,42.65 C9.2 v44.13,42.55
  other vias: 26.99,28.89 30.48,32.38 33.97,28.89 30.48,25.4 3.81,2.54 5.4,54.61 9.53,56.83 12.38,51.12 10.79,43.18 14.61,45.4 19.37,45.09 23.5,58.42 34.92,57.78 27.3,51.75 28.57,45.09 36.51,52.07 33.02,48.58 55.24,58.42 53.02,58.42 53.02,51.12 47.31,51.12 42.23,51.12 40.64,46.04 56.2,34.29 40.96,25.72 40.01,19.37 51.44,19.37 42.86,23.18 43.81,27.62 44.77,31.75 51.44,25.08 51.44,30.16 24.45,28.57 17.46,29.53 24.13,33.34 24.45,35.24 19.37,42.55 10.79,39.05 10.48,31.43 16.51,24.13 12.06,24.45 11.11,27.3 14.61,21.91 11.11,7.94 22.86,3.81 23.18,5.71 21.27,7.94 20.95,14.29 15.24,17.14 20.64,17.14 11.11,12.7 25.72,20.32 33.97,20.32 37.78,22.54 52.39,10.16 39.05,15.56 39.05,10.16 26.04,10.16 30.48,17.14 38.42,5.08 40.64,3.81 45.72,3.81 50.8,3.81 57.15,7.3 25.08,5.08 30.48,3.81 3.81,8.57 12.38,19.37 48.58,33.02 51.44,27.62 51.44,22.54 51.44,32.7 46.67,32.38 40.96,30.48 23.18,51.44 43.81,36.83 51.44,36.83 51.44,40.32 51.44,46.99 45.09,46.35 45.09,44.45 20.95,34.92
  pour Route15 (isolate 0.305): 0.64,61.28 0.64,0.64 60.33,0.64 60.33,61.28
  pour Top: 26.35,28.89 30.48,33.02 34.61,28.89 30.48,24.77
  pour Bottom (isolate 0.406): 0.64,61.28 0.64,0.64 60.33,0.64 60.33,61.28
  pour Top (isolate 0.406): 0.64,61.28 0.64,0.64 46.04,0.64 46.04,61.28
  pour Top (isolate 0.406): 46.04,61.28 46.04,43.81 51.44,43.81 51.44,39.05 49.85,39.05 49.85,37.15 46.04,37.15 46.04,0.64 60.33,0.64 60.33,61.28
LEDBTN  (via drill 0.2)
  Top 0.203: U1.2 28.57,33.98 v28.57,34.92
  Top 0.305: 26.67,11.33 R9.1 26.67,11.53 26.67,13.87 R10.1 26.67,14.07 v26.67,15.24 | v21.59,15.24 v21.59,24.13
  Bottom 0.305: v26.67,15.24 v21.59,15.24 | v28.57,34.92 28.57,33.97 21.59,26.99 v21.59,24.13
LX
  Top 0.508: U3.3 48.08,46.35 49.21,45.22 L2.2
N$1
  Top 0.203: U1.5 26.67,33.76 26.67,35.04 23.18,38.53 23.18,40.26 24.39,41.47 Y1.1 24.77,41.53 C3.1
N$2
  Top 0.203: U1.6 26.04,33.69 26.04,34.92 22.54,38.42 22.54,38.73 | 21.15,39.17 Y1.3 22.11,39.17 22.23,39.05 | C4.1 21.8,43.28 22.54,42.55 22.54,39.37 | 22.54,39.05 22.54,38.73 | 22.23,39.05 22.54,39.05 | 22.23,39.05 22.54,39.37 | 22.23,39.05 22.54,38.73 | 22.54,39.37 22.54,39.05
N$3
  Top 0.203: U1.3 27.94,33.91 27.94,35.24 29.21,36.51 32.38,36.51 33.02,37.15 JP2.2
N$4
  Top 0.203: U1.4 27.3,33.84 27.3,35.24 29.21,37.15 JP1.2
N$5  (via drill 0.2)
  Top 0.203: U1.32 35.77,24.66 v35.88,24.77
  Top 0.305: v13.34,44.45 R2.1
  Bottom 0.305: v35.88,24.77 36.51,25.4 36.51,42.23 34.61,44.13 13.65,44.13 v13.34,44.45
N$6  (via drill 0.2)
  Top 0.203: U1.33 35.42,25.72 v35.88,25.72
  Top 0.305: v11.43,44.13 R3.1
  Bottom 0.305: v35.88,25.72 35.88,41.91 34.29,43.5 11.75,43.5 11.43,43.81 v11.43,44.13
N$7  (via drill 0.2)
  Top 0.254: v14.92,52.46 14.91,52.46 14.76,52.61 J4.B5 | v10.16,52.7 R4.2
  Bottom 0.254: v14.92,52.46 10.4,52.46 v10.16,52.7
N$8  (via drill 0.2)
  Top 0.254: J4.A5 17.76,52.73 v18.1,52.39 | v10.16,50.8 R5.2
  Bottom 0.254: v18.1,52.39 17.46,51.75 14.61,51.75 14.29,52.07 11.43,52.07 v10.16,50.8
N$9
  Top 0.508: FB3.1 21.91,51.33 L1.1
N$10
  Top 0: 11.43,13.97 11.75,13.65 arc-37 12.7,11.75 arc21 13.34,9.84 arc45 14.92,8.57 arc32 15.88,8.57 arc-32 19.05,8.57 arc32 20.32,8.57 arc30 21.91,9.53
N$11  (via drill 0.2, 0.3)
  Top 0.305: U2.4 15.41,47.14 16.19,46.35 19.05,46.35 v20,47.31 | R12.1 v40.96,51.12
  Top 0.508: D2.A v45.72,51.12 | L1.2 v20,47.31
  Bottom 0.305: v40.96,51.12 40.96,50.8 41.91,49.85 44.45,49.85 v45.72,51.12
  Bottom 0.508: v45.72,51.12 46.99,52.39 48.58,52.39 51.12,54.93 51.12,59.69 50.48,60.33 26.99,60.33 22.54,55.88 22.54,53.02 20,50.48 v20,47.31
N$12
  Top 0.305: JP1.1 30.02,38.88 29.84,39.05 29.84,39.69 | 29.84,39.69 Y2.2 | C6.1 29.63,39.47 29.84,39.69
N$13
  Top 0.305: JP2.1 32.21,38.88 32.38,39.05 32.38,39.69 | 32.38,39.69 Y2.1 | C5.1 32.6,39.47 32.38,39.69
N$14
  Top 0.203: U1.9 24.9,32.7 22.23,32.7 | 22.23,32.7 20.54,32.7 FB1.1 | C1.1 22.23,32.7
N$15
  Top 0: 13.65,15.88 14.61,15.56 arc-31 16.51,14.29 arc77 21.59,13.34
N$16
  Top 0.305: C7.1 R10.2 28.57,14.07 28.57,15.87 S3.2 | R11.2 32.38,11.53 32.38,13.87 C7.1 | C7.1 32.38,14.07
N$17
  Top 0.305: R9.2 28.57,11.53 28.57,12.06 29.45,12.94 D1.A
N$18  (via drill 0.2)
  Top 0.203: U1.1 29.21,34.05 29.21,34.61 v29.53,34.92
  Top 0.305: v33.34,42.86 33.34,46.35 33.87,46.89 R7.1 35.88,48.26 J6.1
  Bottom 0.305: v29.53,34.92 31.11,34.92 31.75,35.56 31.75,41.27 v33.34,42.86
N$19  (via drill 0.2, 0.3)
  Top 0.305: Q1.1 50.48,49.84 50.48,49.85 v50.48,51.12
  Top 0.61: D3.A v48.58,51.12
  Bottom 0.61: J1.1 7.3,58.42 7.94,57.78 21.27,57.78 24.77,61.28 51.44,61.28 | J2.20 54.29,61.28 52.7,61.28 | 51.44,61.28 52.07,61.28 | 52.07,61.28 52.7,61.28 | v48.58,51.12 v50.48,51.12 52.07,52.7 52.07,60.64 | 52.07,60.64 52.07,61.28 | 52.07,60.64 52.7,61.28 | 52.07,60.64 51.44,61.28
N$25  (via drill 0.2)
  Top 0.305: v42.86,24.13 R13.1
  Bottom 0.305: J5.6 43.81,58.74 43.5,59.05 37.47,59.05 36.51,58.1 36.51,54.61 39.37,51.75 39.37,39.05 42.86,35.56 v42.86,24.13
N$26  (via drill 0.2)
  Top 0.305: v42.86,21.91 R14.1
  Bottom 0.305: J5.8 46.35,59.37 46.04,59.69 37.15,59.69 35.88,58.42 35.88,54.29 38.73,51.44 38.73,38.73 41.91,35.56 41.91,22.23 42.23,21.91 v42.86,21.91
N$39
  Top 0.305: R15.1 D4.A
P-0  (via drill 0.2)
  Top 0.203: U1.10 25.15,31.75 16.83,31.75 9.84,38.73 9.84,46.67 v8.26,48.26 J1.5
  Bottom 0.305: v8.26,48.26 6.35,46.35 J3.1
P-1  (via drill 0.2)
  Top 0.203: U1.11 25.08,31.11 16.51,31.11 9.21,38.42 9.21,44.77 v8.26,45.72 J1.6
  Bottom 0.305: J3.2 8.89,3.81 6.99,5.71 6.99,44.45 v8.26,45.72
P-2  (via drill 0.2)
  Top 0.203: U1.12 25,30.48 16.19,30.48 8.57,38.1 8.57,42.86 v8.26,43.18 J1.7
  Bottom 0.305: J3.3 11.43,3.81 10.79,4.45 9.21,4.45 7.62,6.03 7.62,42.55 v8.26,43.18
P-3  (via drill 0.2)
  Top 0.203: U1.13 25,27.3 18.41,27.3 v8.41,37.31 5.08,40.64 J1.8
  Bottom 0.305: J3.4 13.97,3.81 12.7,5.08 9.53,5.08 8.26,6.35 8.26,37.15 v8.41,37.31
P-4  (via drill 0.2)
  Top 0.203: U1.14 25.08,26.67 18.1,26.67 v9.05,35.72 6.67,38.1 J1.9
  Bottom 0.305: J3.5 16.51,3.81 14.61,5.71 9.84,5.71 8.89,6.67 8.89,35.56 v9.05,35.72
P-5  (via drill 0.2)
  Top 0.203: U1.15 25.15,26.04 17.78,26.04 v9.68,34.13 8.26,35.56 J1.10
  Bottom 0.305: J3.6 19.05,3.81 16.51,6.35 10.16,6.35 9.53,6.99 9.53,33.97 v9.68,34.13
P-6
  Top 0.203: U1.16 25.22,25.4 17.46,25.4 9.84,33.02 J1.11
P-7  (via drill 0.2)
  Top 0.203: U1.17 25.29,24.77 17.14,24.77 11.43,30.48 v10.48,30.48 J1.12
  Bottom 0.305: J3.7 21.59,3.81 18.41,6.99 10.48,6.99 10.16,7.3 10.16,30.16 v10.48,30.48
P-8  (via drill 0.2)
  Top 0.203: U1.29 37.04,21.27 v38.1,21.27 v38.1,6.03
  Top 0.305: J1.13 7.3,27.94 v13.34,21.91
  Bottom 0.305: J3.8 24.13,5.71 24.45,6.03 v38.1,6.03 | v38.1,21.27 37.47,20.64 36.2,20.64 34.92,19.37 15.88,19.37 v13.34,21.91
P-9  (via drill 0.2)
  Top 0.203: R14.2 v38.73,21.91 37.11,21.91 U1.30
  Top 0.305: J1.14 8.89,25.4 v13.34,20.95
  Bottom 0.305: v13.34,20.95 15.56,18.73 35.24,18.73 36.51,20 38.42,20 39.05,20.64 39.05,21.59 v38.73,21.91
P-10  (via drill 0.2)
  Top 0.203: U1.31 35.6,24.13 38.42,24.13 | 38.42,24.13 38.73,24.13 | 38.73,24.13 39.05,24.13 | 39.05,24.13 R13.2 | v38.73,23.18 38.73,23.81 | 38.73,24.13 38.73,23.81 | 38.73,23.81 38.42,24.13 | 38.73,23.81 39.05,24.13
  Top 0.305: J1.15 10.48,22.86 v13.34,20
  Bottom 0.305: v13.34,20 15.24,18.1 35.56,18.1 36.83,19.37 38.73,19.37 39.69,20.32 39.69,22.23 v38.73,23.18
P-11  (via drill 0.2)
  Top 0.305: J1.16 v11.43,20.32 | JP2.3 v34.61,37.78
  Bottom 0.305: v34.61,37.78 34.61,34.92 22.54,22.86 13.02,22.86 11.43,21.27 v11.43,20.32
P-12  (via drill 0.2)
  Top 0.305: JP1.3 v27.62,37.78 | J1.17 v10.79,17.78
  Bottom 0.305: v10.79,17.78 10.79,21.59 12.7,23.5 16.83,23.5 27.62,34.29 v27.62,37.78
P-13  (via drill 0.2)
  Top 0.203: U1.34 35.49,26.35 36.51,26.35 37.15,25.72 v38.42,25.72
  Top 0.305: J5.5 43.81,53.66 43.5,53.34 39.37,53.34 38.42,52.39 v38.42,36.51 | J1.18 9.84,15.24 v15.56,20.95
  Bottom 0.305: v38.42,36.51 v38.42,25.72 38.42,25.4 36.51,23.5 26.67,23.5 23.81,20.64 15.88,20.64 v15.56,20.95
P-14  (via drill 0.2)
  Top 0.203: U1.37 35.64,30.16 v37.15,30.16
  Top 0.305: J5.1 38.73,54.61 37.15,53.02 v37.15,36.51 | J1.19 8.26,12.7 v16.83,21.27
  Bottom 0.305: v37.15,36.51 v37.15,30.16 37.15,25.08 36.2,24.13 26.35,24.13 23.5,21.27 v16.83,21.27
P-15  (via drill 0.2)
  Top 0.203: U1.38 35.57,30.8 v39.69,30.8
  Top 0.305: J5.9 48.9,53.02 47.94,52.07 40.01,52.07 39.69,51.75 v39.69,36.51 | J1.20 6.99,10.16 v16.83,20
  Bottom 0.305: v39.69,36.51 v39.69,30.8 39.69,30.16 40.64,29.21 40.64,26.67 36.83,22.86 26.99,22.86 24.13,20 v16.83,20
P-16  (via drill 0.2)
  Top 0.203: U1.18 22.23,20.99 v22.23,6.67
  Top 0.305: J3.16 v44.45,6.67
  Bottom 0.305: v22.23,6.67 v44.45,6.67 55.24,6.67 57.15,8.57 J2.1
P-17  (via drill 0.2)
  Top 0.203: U1.19 22.86,20.92 v22.86,7.3
  Top 0.305: v46.99,7.3 J3.17
  Bottom 0.305: v22.86,7.3 v46.99,7.3 54.29,7.3 55.24,8.26 55.24,12.06 55.88,12.7 J2.2
P-18  (via drill 0.2)
  Top 0.203: U1.20 23.5,20.85 v23.5,7.94
  Top 0.305: v41.91,7.94 J3.15 | J2.3 52.39,15.24 51.75,14.61 R8.2
  Bottom 0.305: v23.5,7.94 v41.91,7.94 53.98,7.94 54.61,8.57 54.61,13.97 55.88,15.24 J2.3
P-19  (via drill 0.2)
  Top 0.203: U1.39 35.49,31.43 v37.78,31.43 41.27,31.43 54.93,17.78 J2.4
  Top 0.305: J5.3 41.27,54.29 40.96,53.98 39.05,53.98 37.78,52.7 v37.78,37.15
  Bottom 0.305: v37.78,37.15 v37.78,31.43
P-20  (via drill 0.2)
  Top 0.203: U1.40 35.42,32.07 v39.05,32.07 43.18,32.07 54.93,20.32 J2.5
  Top 0.305: J5.7 46.35,53.02 46.04,52.7 39.69,52.7 39.05,52.07 v39.05,37.15
  Bottom 0.305: v39.05,37.15 v39.05,32.07
P-21
  Top 0.203: U1.41 35.35,32.7 45.09,32.7 54.93,22.86 J2.6
P-22
  Top 0.203: U1.42 35.28,33.34 46.99,33.34 54.93,25.4 J2.7
P-23
  Top 0.203: U1.43 35.21,33.97 48.9,33.97 54.93,27.94 J2.8
P-24
  Top 0.203: U1.45 35.06,35.24 50.16,35.24 54.93,30.48 J2.9
  Top 0.305: J3.9 26.67,1.27 27.3,0.64 55.88,0.64 59.37,4.13 59.37,29.53 58.42,30.48 J2.9
P-25
  Top 0.203: U1.46 34.99,35.88 51.75,35.88 54.61,33.02 J2.10
  Bottom 0.305: J3.10 29.21,1.27 29.53,0.95 55.88,0.95 59.05,4.13 59.05,32.38 58.42,33.02 J2.10
P-26  (via drill 0.2)
  Top 0.203: U1.21 24.13,20.77 v24.13,8.57
  Top 0.305: J3.19 v52.07,8.57
  Bottom 0.305: v24.13,8.57 v52.07,8.57 53.02,8.57 53.98,9.53 53.98,14.92 55.56,16.51 55.56,35.24 55.88,35.56 J2.11
P-27  (via drill 0.2)
  Top 0.203: U1.22 24.77,20.7 v24.77,9.21
  Top 0.305: v49.53,9.21 J3.18
  Bottom 0.305: v24.77,9.21 v49.53,9.21 52.7,9.21 53.34,9.84 53.34,15.24 54.93,16.83 54.93,37.15 55.88,38.1 J2.12
P-28  (via drill 0.2)
  Top 0.203: U1.25 35.56,19.92 v35.56,16.51 v35.56,4.13
  Bottom 0.305: J2.13 55.88,40.64 54.29,39.05 54.29,17.78 53.02,16.51 v35.56,16.51 | v35.56,4.13 39.05,4.13 39.37,3.81 J3.14
P-29  (via drill 0.2)
  Top 0.203: U1.26 36.2,20 v36.2,17.14 36.2,3.17 J3.13
  Bottom 0.305: J2.14 55.88,43.18 53.66,40.96 53.66,18.41 52.39,17.14 v36.2,17.14
P-30  (via drill 0.2)
  Top 0.203: U1.27 36.83,20.07 v36.83,17.78 36.83,4.76 38.1,3.49 38.1,1.65 37.78,1.33 34.54,1.33 34.29,1.59 J3.12
  Bottom 0.305: J2.15 55.88,45.72 53.02,42.86 53.02,18.73 52.07,17.78 v36.83,17.78
P-31  (via drill 0.2)
  Top 0.203: U1.28 37.47,20.14 v37.47,18.41 v37.47,5.4
  Bottom 0.305: J3.11 31.75,4.76 32.38,5.4 v37.47,5.4 | J2.16 55.88,48.26 52.39,44.77 52.39,19.05 51.75,18.41 v37.47,18.41
VBUS  (via drill 0.3)
  Top 0.508: J4.A4 18.91,52.63 19.1,52.44 | 19.1,52.44 19.58,51.96 | 19.58,51.96 FB3.2 v19.05,51.44 | J4.B4 14.11,51.58 v13.65,51.12 | v19.05,51.44 19.58,51.96 | 19.1,52.44 19.1,51.49 v19.05,51.44
  Bottom 0.508: v19.05,51.44 18.73,51.12 v13.65,51.12
VFB
  Top 0.305: U3.6 43.69,43.5 43.18,42.99 43.18,41.91 43.81,41.27 43.81,40.42 R17.2 C13.2 45.09,40.22 45.09,38.2 R16.1
VIN
  Top 0.508: U3.4 43.5,46.54 C8.1 43.6,47.94 44.45,47.94 44.77,48.26 45.7,48.26 D2.C
  Top 1.016: D2.C D3.C

### Text on the board
tPlace: 5V IN | 5V IN | 3.3V | 3.3V | GND | GND | PA0 | PB15 | PA1 | PB14 | PA2 | PB13 | PA3 | PB12 | PA4 | PB11 | PA5 | PB10 | PA6 | PB9 | PA7 | PB8 | PA8 | PB7 | PA9 | PB6 | PA10 | PB5 | PC14 | PB4 | PC15 | PB3 | PA13 | BOOT1/PB2 | PA14 | GD32VF uc-Board / S 2021 | PB1 | PA15 | PB0 | PA0 | PA1 | PA2 | PA3 | PA4 | PA5 | PA7 | PA8 | PB8 | PB9 | PB15 | PB14 | PB13 | PB12 | PB2 | PB0 | PB1 | PB11 | PB10 | GND